# Altium schematic sheet PowerHalfBridge.SchDoc
size A3
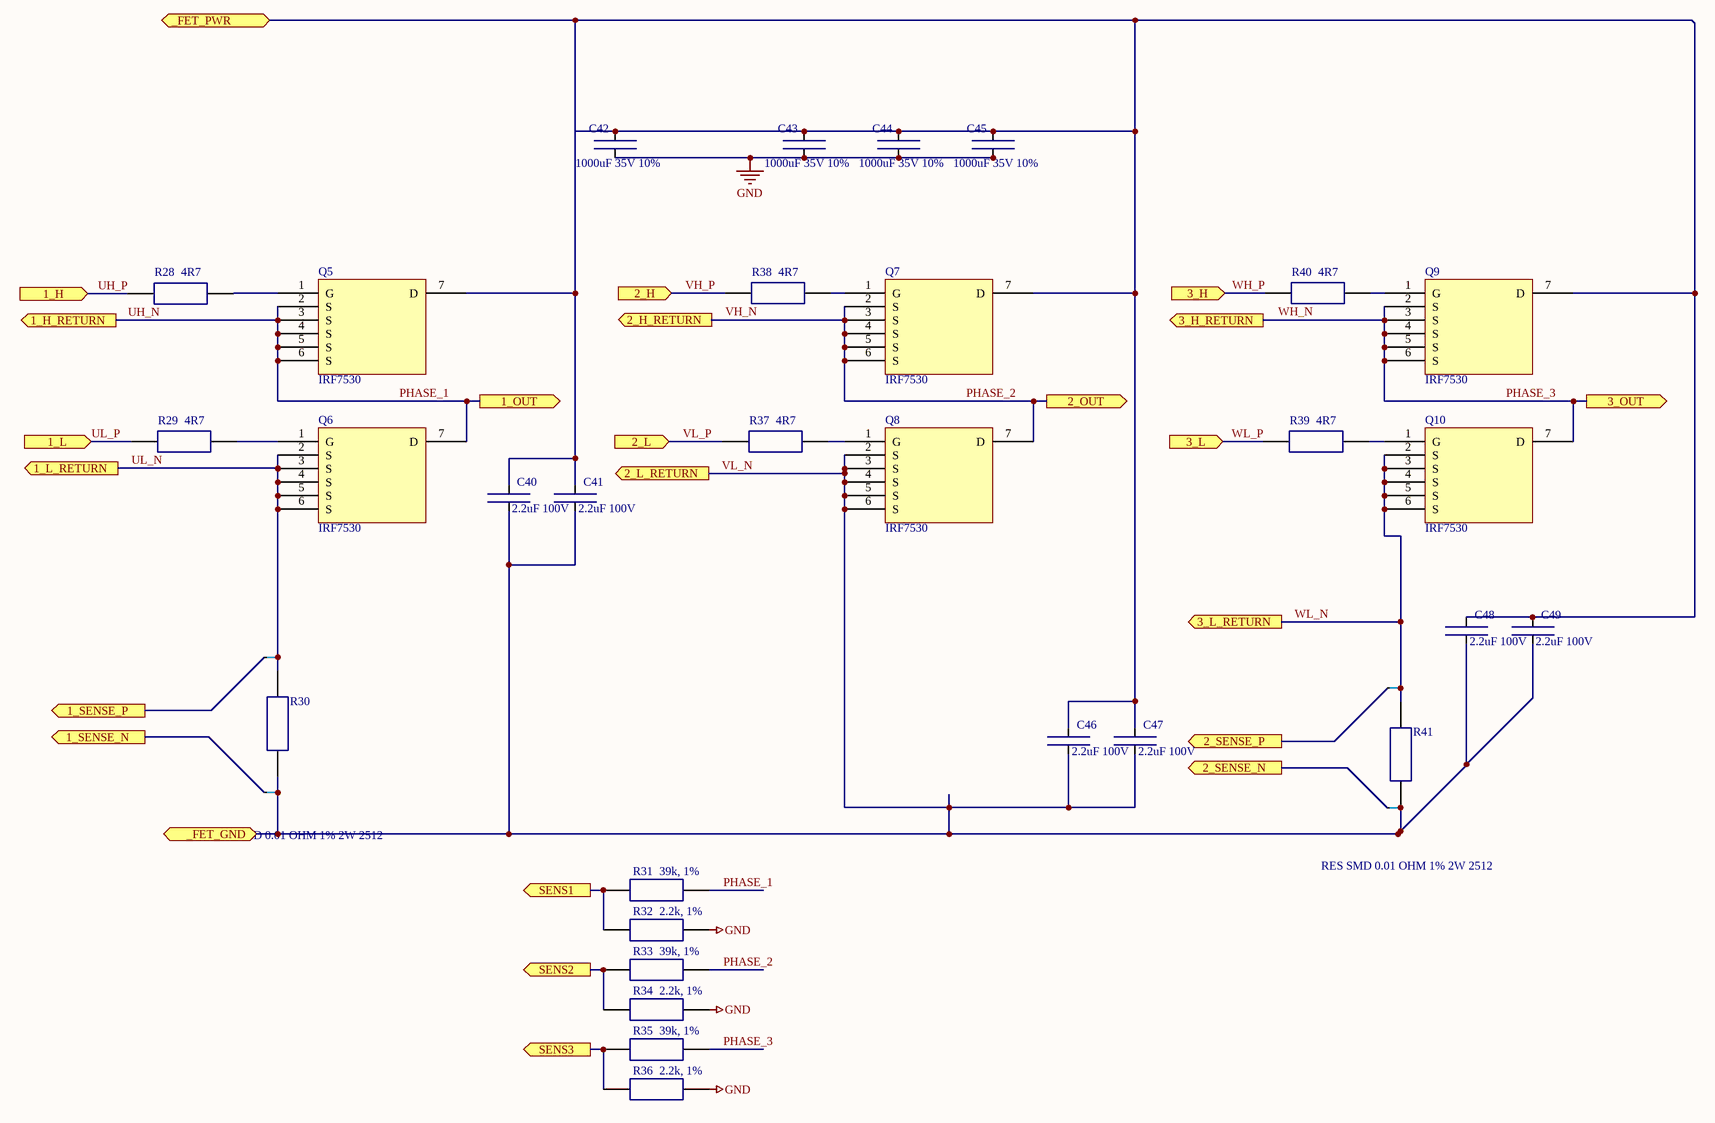
[diagram p0: PowerHalfBridge.SchDoc]

## Parts
C40  2.2uF 100V  [1210]
C41  2.2uF 100V  [1210]
C42  1000uF 35V 10%  [CAP_1000u_35V]
C43  1000uF 35V 10%  [CAP_1000u_35V]
C44  1000uF 35V 10%  [CAP_1000u_35V]
C45  1000uF 35V 10%  [CAP_1000u_35V]
C46  2.2uF 100V  [1210]
C47  2.2uF 100V  [1210]
C48  2.2uF 100V  [1210]
C49  2.2uF 100V  [1210]
NT2  NET_TIE  [NET_TIE_10mil]  (value not drawn)  (net tie, no BOM)
NT3  NET_TIE  [NET_TIE_10mil]  (value not drawn)  (net tie, no BOM)
NT4  NET_TIE  [NET_TIE_10mil]  (value not drawn)  (net tie, no BOM)
NT5  NET_TIE  [NET_TIE_10mil]  (value not drawn)  (net tie, no BOM)
Q5  IRF7530  [D2PAK-7]
Q6  IRF7530  [D2PAK-7]
Q7  IRF7530  [D2PAK-7]
Q8  IRF7530  [D2PAK-7]
Q9  IRF7530  [D2PAK-7]
Q10  IRF7530  [D2PAK-7]
R28  4R7  [0603x]
R29  4R7  [RESC1608X05N(0603)]
R30  RES SMD 0.01 OHM 1% 2W 2512  [1T-2512-5x]
R31  39k, 1%  [0805x]
R32  2.2k, 1%  [0805x]
R33  39k, 1%  [0805x]
R34  2.2k, 1%  [0805x]
R35  39k, 1%  [0805x]
R36  2.2k, 1%  [0805x]
R37  4R7  [RESC1608X05N(0603)]
R38  4R7  [RESC1608X05N(0603)]
R39  4R7  [RESC1608X05N(0603)]
R40  4R7  [RESC1608X05N(0603)]
R41  RES SMD 0.01 OHM 1% 2W 2512  [1T-2512-5x]

## Ports
1_H (in), 1_H_RETURN (out), 1_L (in), 1_L_RETURN (out), 1_OUT (out), 1_SENSE_N (out), 1_SENSE_P (out), 2_H (in), 2_H_RETURN (out), 2_L (in), 2_L_RETURN (out), 2_OUT (out), 2_SENSE_N (out), 2_SENSE_P (out), 3_H (in), 3_H_RETURN (out), 3_L (in), 3_L_RETURN (out), 3_OUT (out), _FET_GND, _FET_PWR, SENS1 (out), SENS2 (out), SENS3 (out)

## Nets
GND: C42.2 C43.2 C44.2 C45.2 R32.2 R34.2 R36.2
1_SENSE_N: NT3.1 ; port 1_SENSE_N
1_SENSE_P: NT2.1 ; port 1_SENSE_P
2_SENSE_N: NT5.1 ; port 2_SENSE_N
2_SENSE_P: NT4.1 ; port 2_SENSE_P
_FET_PWR: C40.1 C41.1 C42.1 C43.1 C44.1 C45.1 C46.1 C47.1 C48.1 C49.1 Q5.7(D) Q7.7(D) Q9.7(D) ; port _FET_PWR
PHASE_1: Q5.2(S) Q5.3(S) Q5.4(S) Q5.5(S) Q5.6(S) Q6.7(D) R31.2 ; port 1_H_RETURN, port 1_OUT  [also labelled UH_N]
PHASE_2: Q7.2(S) Q7.3(S) Q7.4(S) Q7.5(S) Q7.6(S) Q8.7(D) R33.2 ; port 2_OUT, port 2_H_RETURN  [also labelled VH_N]
PHASE_3: Q9.2(S) Q9.3(S) Q9.4(S) Q9.5(S) Q9.6(S) Q10.7(D) R35.2 ; port 3_OUT, port 3_H_RETURN  [also labelled WH_N]
SENS1: R31.1 R32.1 ; port SENS1
SENS2: R33.1 R34.1 ; port SENS2
SENS3: R35.1 R36.1 ; port SENS3
UH_P: R28.1 ; port 1_H
UL_N: NT2.2 Q6.2(S) Q6.3(S) Q6.4(S) Q6.5(S) Q6.6(S) R30.1 ; port 1_L_RETURN
UL_P: R29.1 ; port 1_L
VH_P: R38.1 ; port 2_H
VL_N: C40.2 C41.2 C46.2 C47.2 C48.2 C49.2 NT3.2 NT5.2 Q8.2(S) Q8.3(S) Q8.4(S) Q8.5(S) Q8.6(S) R30.2 R41.2 ; port 2_L_RETURN, port _FET_GND
VL_P: R37.1 ; port 2_L
WH_P: R40.1 ; port 3_H
WL_N: NT4.2 Q10.2(S) Q10.3(S) Q10.4(S) Q10.5(S) Q10.6(S) R41.1 ; port 3_L_RETURN
WL_P: R39.1 ; port 3_L
NetQ5_1: Q5.1(G) R28.2
NetQ6_1: Q6.1(G) R29.2
NetQ7_1: Q7.1(G) R38.2
NetQ8_1: Q8.1(G) R37.2
NetQ9_1: Q9.1(G) R40.2
NetQ10_1: Q10.1(G) R39.2

## Notes on the sheet
- Title
- Size:
- Date:
- A3
- Number:
- Time:
- Revision:
- Sheet
- of
- File:

## Library data of the parts
C40 C41 C46-C49 = Ceramic Chip Capacitor: Value: CAP CER 2.2UF 100V X7R 1210; Order Number: C1210X225K1RACAUTO; Distributor: KEMET; Package: 1210
C42-C45 = Ceramic Chip Capacitor: Value: CAP CER 0.022UF 50V X7R 0402; Order Number: GRM155R71H223KA12D; Distributor: Murata Electronics; Package: 0402
NT2-NT5 = Net tie
R28 R29 R37-R40 = SMD: Value: RES SMD 4.7 OHM 5% 1/10W 0603; Order Number: ERJ-3GEYJ4R7V; Distributor: Panasonic
  R28 R29 R37 R39 R40: Package: RESC1608X05N(0603)
  R38: Package: 0603
R30 R41 = SMD: Order Number: WSL2512R0100FEA; Value: RES SMD 0.01 OHM 1% 2W 2512; Package: 2512; Distributor: Vishay Dale
R31 R33 R35 = SMD: Order Number: ERJ-3EKF3902V; Value: 39k, 1%; Package: RESC1608X05N(0603); Distributor: Panasonic
R32 R34 R36 = SMD: Order Number: ERJ-3EKF2201V; Value: 2.2k, 1%; Package: RESC1608X05N(0603); Distributor: Panasonic